# EAGLE design RFID_Antenna (EAGLE 9.3.0)
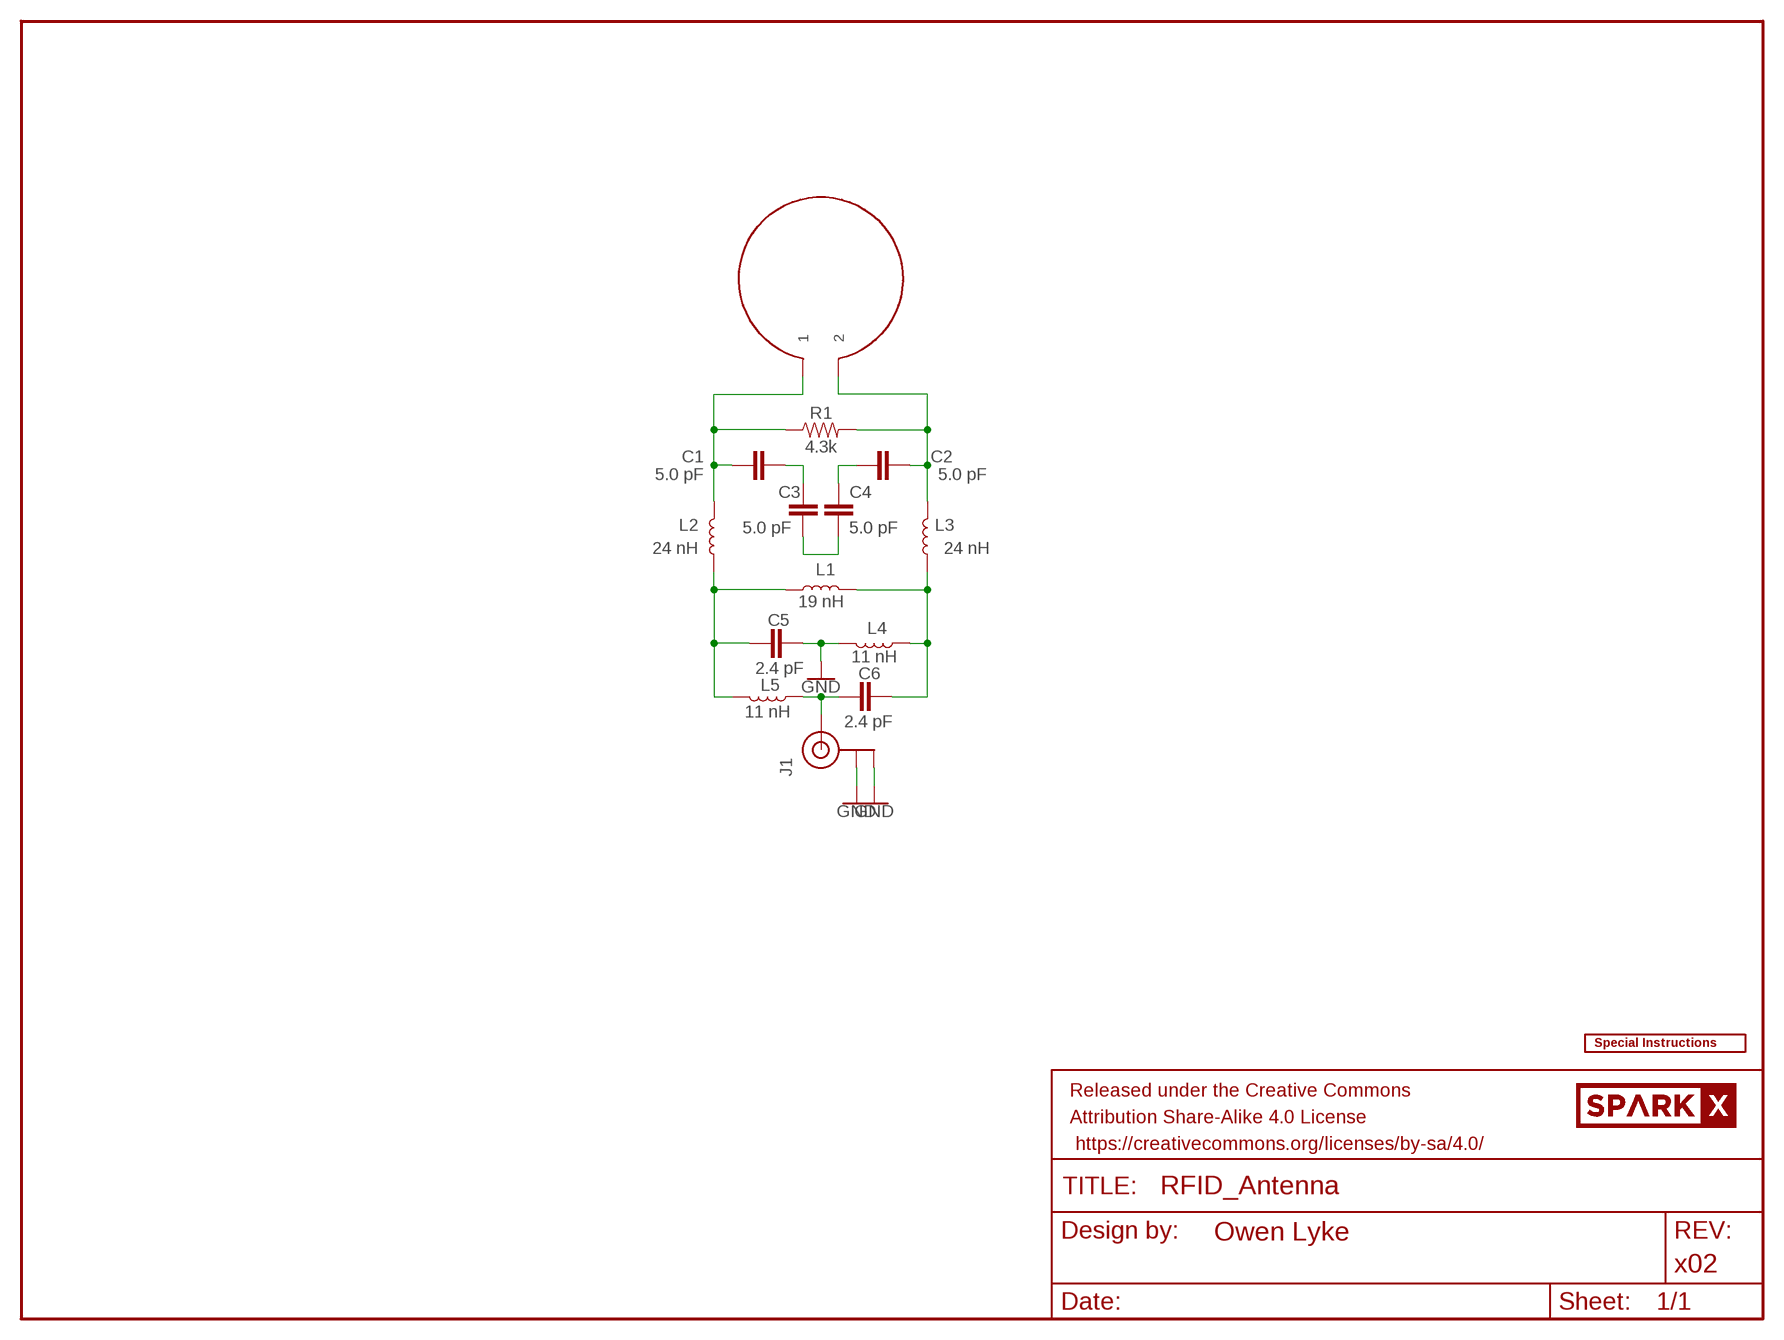
[diagram p0: schematic, sheet 1]

## Parts
C1  5.0 pF  5.0PF-0402  [0402_MURATA]
C2  5.0 pF  5.0PF-0402  [0402_MURATA]
C3  5.0 pF  5.0PF-0402  [0402_MURATA]
C4  5.0 pF  5.0PF-0402  [0402_MURATA]
C5  2.4 pF  2.4PF-0402  [0402_MURATA]
C6  2.4 pF  2.4PF-0402  [0402_MURATA]
FRAME1  FRAME-LETTER  [CREATIVE_COMMONS]
J1  U.FL  [U.FL]
L1  19 nH  19NH-0402  [0402_MURATA]
L2  24 nH  24NH-0603  [0603_MURATA]
L3  24 nH  24NH-0603  [0603_MURATA]
L4  11 nH  11NH-0603  [0603_MURATA]
L5  11 nH  11NH-0603  [0603_MURATA]
R1  4.3k  4.3KOHM-0402  [0402_MURATA]
U$1  ANTENNA  [ANT]
U$2  SPECIAL_INSTRUCTIONS-ORDERING  [ORDERING_INSTRUCTIONS]
U$12  SPARKX-LOGO5  [SPARKX-LARGE]

## Nets
A1: C1.P$1 L2.P$2 R1.P$1 U$1.P$1 U$1.P$3
A2: C2.P$2 L3.P$2 R1.P$2 U$1.P$2 U$1.P$4
C1C3: C1.P$2 C3.P$1
C2C4: C2.P$1 C4.P$1
C3C4: C3.P$2 C4.P$2
GND: C5.P$1 J1.1(GND) J1.2(GND) L4.P$2
L5C6: C6.P$2 J1.FEED(SIGNAL) L5.P$1
N$6: C6.P$1 L1.P$2 L3.P$1 L4.P$1
N$7: C5.P$2 L1.P$1 L2.P$1 L5.P$2

## Library data of the parts
C1-C4 = SparkFun-Capacitors:5.0PF; PROD_ID: CAP-14350
C5 C6 = SparkFun-Capacitors:2.4PF; PROD_ID: CAP-14351
FRAME1 = SparkFun-Aesthetics:FRAME-LETTER: Schematic Frame - Letter Standard 8.5x11 US Letter frame; DESIGNER: Owen Lyke; REV: x02
J1 = SparkFun-Connectors:U.FL: SMD Antenna Connector - U.FL 2mm height, 3.0mm x 3.0mm receptacle size. SparkFun Products: SparkFun WiFi Shield - ESP8266 <https://www.sparkfun.com/products/13287> SparkFun ESP8266 Thing <https://www.sparkfun.com/products/13231> SparkFun MiniGen - Pro Mini Signal Generator Shield <https://www.sparkfun.com/products/11420>; PROD_ID: CONN-09193; SF_ID: WRL-09144
L1 = SparkFun-Coils:19NH; PROD_ID: NDUC-14352
L2 L3 = SparkFun-Coils:24NH; PROD_ID: NDUC-14353
L4 L5 = SparkFun-Coils:11NH; PROD_ID: NDUC-14354
R1 = SparkFun-Resistors:4.3KOHM; PROD_ID: RES-14355
U$1 = special_parts:ANTENNA
U$2 = SparkFun-Aesthetics:SPECIAL_INSTRUCTIONS: Special Ordering/Production Instructions Alert Symbol for special PCB ordering instructions or unique production process warnings. Ordering Instructions Production Instructions Types of information that should be added to box: Copper weight Soldermask color Silk color PCB thickness Number of layers PCB Standard: 1.6mm FR4 1 oz copper immersion silver plating red soldermask white silkscreen Types of information that should be added to box: Special wash requirements Depaneling instructions Humidification Glue curing Default text settings: 0.07 inch 9% ratio 50% line distance
U$12 = SparkX:SPARKX-LOGO

## Board
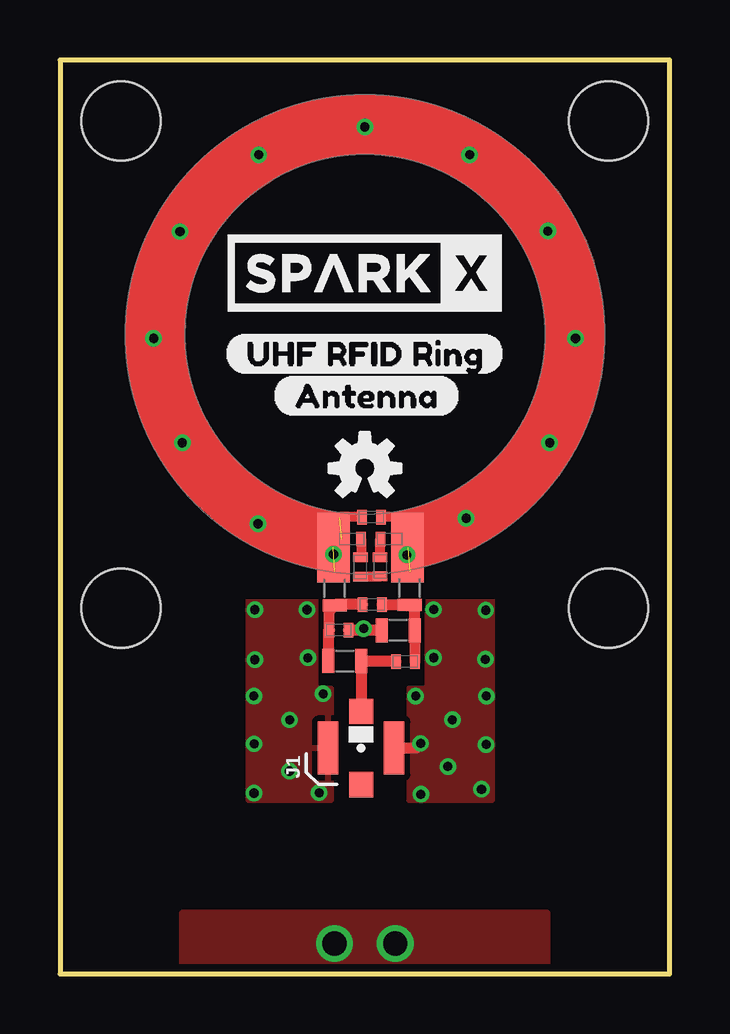
[diagram p1: board, top side]
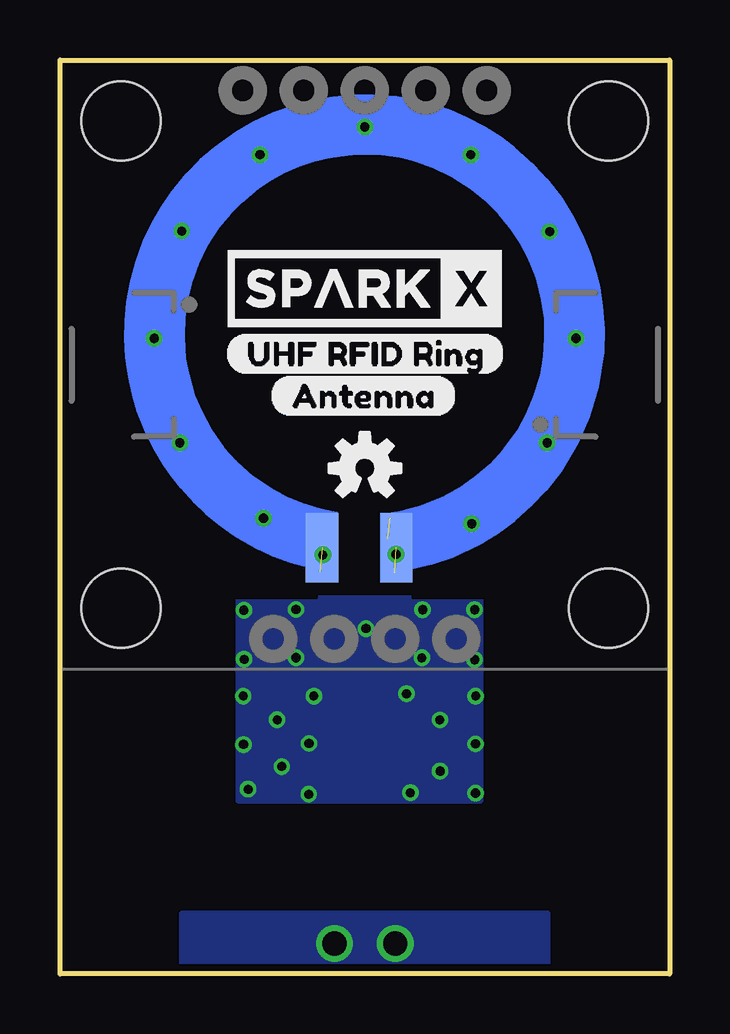
[diagram p2: board, bottom side, seen from below]

Size 25.4 x 38.1 mm. Coordinates in mm from the lower left corner, seen from the top.
Outline: 0,0 25.4,0 25.4,38.1 0,38.1 0,0
Copper layers (1*16): Top 0.035mm / dielectric 1.5mm / Bottom 0.035mm
Design rules "SparkFun-2-layer-PCBWay-LIMIT": minimum track width 6mil, minimum drill 0.3mm, track to track 6mil, track to pad 6mil, pad to pad 6mil, via to via 6mil, smd to smd 6mil, copper to edge 6mil, drill to drill 6mil, minimum pad ring 6mil, minimum via ring 6mil, stop-mask expansion 4mil, vias tented up to drill 25mil, thermal gap 10mil

### Footprints (pad centres in the part's own frame; a part is rotated, then mirrored left to right if it is on the bottom)
0402_MURATA = smd 0.4 x 0.6: P$1 -0.4,0; P$2 0.4,0
U.FL = smd 2.2 x 0.85: 1 0,1.375; 2 0,-1.375 | smd 1.05 x 1: FEED 1.525,0; NC -1.525,0
0603_MURATA = smd 0.5 x 1: P$1 -0.7,0; P$2 0.675,0
ANT = smd 1.35 x 2.9 bottom: P$1 -1.32,-8.895; P$2 1.77,-8.895 | smd 1.35 x 2.9: P$3 -1.32,-8.895; P$4 1.77,-8.895
QWIIC_BOARD_MOUNT_HOLES = hole 3.302: -10.16,10.16; 10.16,10.16; 10.16,-10.16; -10.16,-10.16

### Placement (x,y rotation side)
C1  12.15,18.13 0 top
C2  13.75,18.12 0 top
C3  12.52,16.97 270 top
C4  13.34,16.98 270 top
C5  11.62,14.34 180 top
C6  14.4,13.02 180 top
FRAME1  -15.24,-66.04 0 top  (outside the outline)
J1  12.55,9.42 90 top
L1  13.01,15.4 0 top
L2  11.45,16.07 90 top
L3  14.57,16.08 90 top
L4  14.09,14.33 180 top
L5  11.86,13.04 180 top
R1  12.98,19.04 0 top
U$1  12.71,26.66 0 top
U$2  -34.29,-5.08 0 top  (outside the outline)
U$4  [SPARKX-LARGE]  12.7,28.57 0 bottom
U$5  [UHF_RFID_RING0]  6.83,25.86 0 top
U$6  [UHF_RFID_RING0]  18.54,25.86 0 bottom
U$7  [ANTENNA1]  8.86,24.1 0 top
U$8  [ANTENNA1]  16.66,24.1 0 bottom
U$9  [OSHW-LOGO-S]  12.7,21.08 0 bottom
U$10  [OSHW-LOGO-S]  12.7,21.08 0 top
U$11  [QWIIC_BOARD_MOUNT_HOLES]  12.7,25.4 0 bottom
U$12  12.7,29.21 0 top

### Tracks (layer width: path | path; a pad name or v marks a point on that pad's centre or on a via)
A1  (3 unrouted)
  Top 0.406: R1.P$1 11.67,19.04 11.65,19.02 | C1.P$1 U$1.P$3
A2  (2 unrouted)
  Top 0.406: R1.P$2 14.38,19.04 14.48,18.94 U$1.P$4 14.15,18.1 C2.P$2
C1C3
  Top 0.406: C1.P$2 12.55,17.39 C3.P$1
C2C4
  Top 0.406: C4.P$1 C2.P$1
C3C4
  Top 0.406: C3.P$2 13.33,16.57 C4.P$2
GND  (via drill 0.38)
  Top 0.457: L4.P$2 12.71,14.33 | v12.65,14.4 12.58,14.33 12.71,14.33 | C5.P$1 12.7,14.34 12.71,14.33 | J1.2 14.83,9.42 v15.03,9.61
  other vias: 8.12,15.19 10.29,15.19 10.32,13.18 8.12,13.1 8.08,11.59 8.09,9.59 9.57,10.59 10.96,11.68 8.09,7.54 9.56,8.46 10.8,7.55 15.04,7.49 16.16,8.64 16.35,10.6 14.82,11.59 15.57,13.18 15.57,15.19 17.74,15.16 17.73,13.12 17.77,11.59 17.75,9.56 17.56,7.7
  pour Top: 7.85,15.67 10.65,15.67 10.65,11.92 11.3,11.92 11.3,7.22 7.85,7.22
  pour Top: 14.55,11.92 15.3,11.92 15.3,15.67 18,15.67 18,7.22 14.55,7.22
  pour Bottom: 7.85,15.67 18,15.67 18,11.57 18,7.22 7.85,7.22
GND1  (via drill 1.02)
  other vias: 13.97,1.27 11.43,1.27
  pour Bottom (isolate 0.305): 5.08,2.54 5.08,0 20.32,0 20.32,2.54
  pour Top (isolate 0.305): 5.08,2.54 5.08,0 20.32,0 20.32,2.54
L5C6
  Top 0.457: C6.P$2 13.98,13.04 L5.P$1 12.56,10.95 J1.FEED
N$6
  Top 0.457: L1.P$2 14.56,15.39 L3.P$1 14.79,15.17 L4.P$1 14.79,13.03 C6.P$1
N$7
  Top 0.457: L1.P$1 11.47,15.39 L2.P$1 11.22,15.14 C5.P$2 11.18,14.3 L5.P$2
N$27  (via drill 0.38)
  other vias: 3.9,26.49
N$28  (via drill 0.38)
  other vias: 5.1,22.14
N$29  (via drill 0.38)
  other vias: 8.25,18.77
N$30  (via drill 0.38)
  other vias: 11.4,17.49
N$31  (via drill 0.38)
  other vias: 14.45,17.47
N$32  (via drill 0.38)
  other vias: 16.92,19
N$33  (via drill 0.38)
  other vias: 20.4,22.14
N$34  (via drill 0.38)
  other vias: 21.48,26.49
N$35  (via drill 0.38)
  other vias: 20.33,30.97
N$36  (via drill 0.38)
  other vias: 17.07,34.15
N$37  (via drill 0.38)
  other vias: 12.7,35.31
N$38  (via drill 0.38)
  other vias: 8.28,34.15
N$39  (via drill 0.38)
  other vias: 5,30.94

### Text on the board
tValues: 4.3k | 5.0pF | 5.0pF | 5.0pF | 5.0pF | 24nH | 19nH | 24nH | 2.4pF | 11nH | 11nH | 2.4pF
bValues: 5.0pF
tDocu: 0.8mm thickness | Owen Lyke